# Altium schematic sheet opamps.SchDoc
size A4; Author: Benjie Van Limbergen; DrawnBy: Benjie Van Limbergen; SheetNumber: 3; SheetTotal: 4
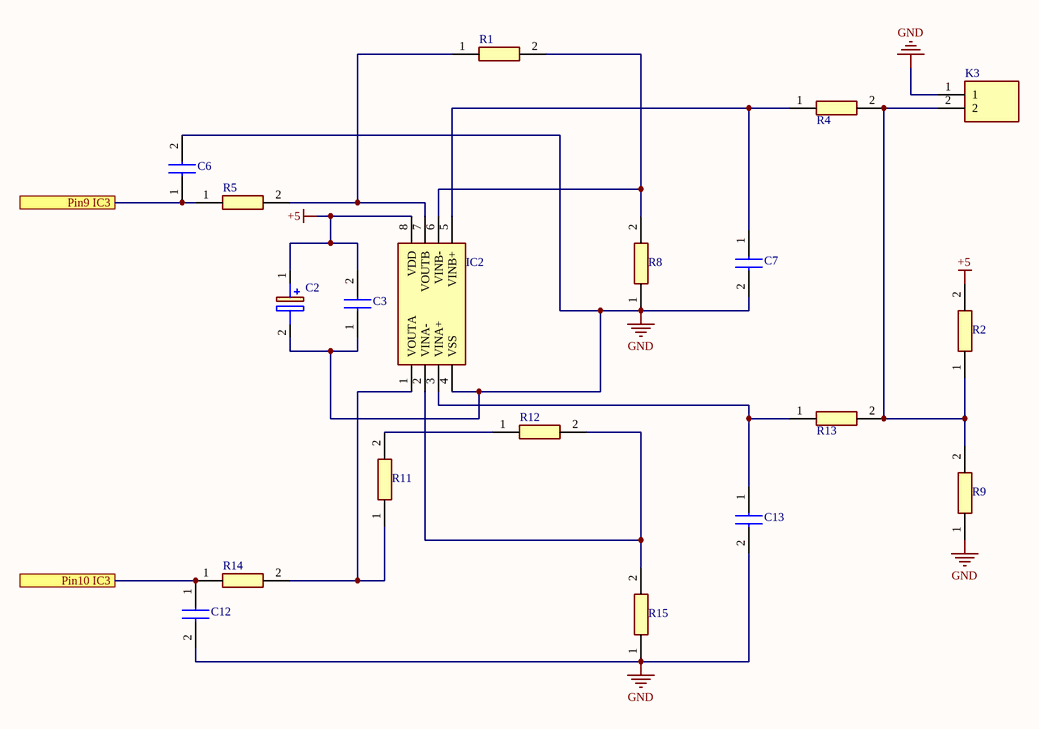
[diagram p0: opamps.SchDoc]

## Parts
C2  860240672002  [CAPPRD200W52D500H1250]  (value not drawn)
C3  885012207098  [CAPC2012X90N]  (value not drawn)
C6  885012205067  [CAPC2012X90N]  (value not drawn)
C7  885012205067  [CAPC2012X90N]  (value not drawn)
C12  885012205067  [CAPC2012X90N]  (value not drawn)
C13  885012205067  [CAPC2012X90N]  (value not drawn)
IC2  MCP6002-E_P  [DIP781W56P254L950H533Q8N]  (value not drawn)
K3  691214110002  [691214110002]  (value not drawn)
R1  smd  [RESC2012X60N]  (value not drawn)
R2  smd  [RESC2012X60N]  (value not drawn)
R4  smd  [RESC2012X60N]  (value not drawn)
R5  smd  [RESC2012X60N]  (value not drawn)
R8  smd  [RESC2012X60N]  (value not drawn)
R9  smd  [RESC2012X60N]  (value not drawn)
R11  smd  [RESC2012X60N]  (value not drawn)
R12  smd  [RESC2012X60N]  (value not drawn)
R13  smd  [RESC2012X60N]  (value not drawn)
R14  smd  [RESC2012X60N]  (value not drawn)
R15  smd  [RESC2012X60N]  (value not drawn)

## Ports
Pin9 IC3, Pin10 IC3

## Nets
+5: C2.1(+) C3.2 IC2.8(VDD) R2.2
GND: C2.2(-) C3.1 C6.2 C7.2 C12.2 C13.2 IC2.4(VSS) K3.1 R8.1 R9.1 R15.1
Pin9 IC3: C6.1 R5.1 ; port Pin9 IC3
Pin10 IC3: C12.1 R14.1 ; port Pin10 IC3
NetC7_1: C7.1 IC2.5(VINB+) R4.1
NetC13_1: C13.1 IC2.3(VINA+) R13.1
NetIC2_1: IC2.1(VOUTA) R11.1 R14.2
NetIC2_2: IC2.2(VINA-) R12.2 R15.2
NetIC2_6: IC2.6(VINB-) R1.2 R8.2
NetIC2_7: IC2.7(VOUTB) R1.1 R5.2
NetK3_2: K3.2 R2.1 R4.2 R9.2 R13.2
NetR11_2: R11.2 R12.1

## Library data of the parts
C2 = 860240672002: Capacitor Polarised 10uf 50v stee 2mm 5x11mm; Manufacturer_Name: Wurth Elektronik; Datasheet Link: https://katalog.we-online.de/pbs/datasheet/860240672002.pdf; Height: 12.5mm; Manufacturer_Part_Number: 860240672002
C3 = 885012207098: Capacitor, C3,C8,C9,C11,C14 100nf; Manufacturer_Name: Wurth Elektronik; Datasheet Link: https://componentsearchengine.com//885012207098.pdf; Height: 0.9mm; Mouser2 Part Number: 710-885012207098; Mouser2 Price/Stock: https://www.mouser.com/Search/Refine.aspx?Keyword=710-885012207098; Manufacturer_Part_Number: 885012207098
C6 C7 C12 C13 = 885012205067: Capacitor C6, C7, C12,C13; Manufacturer_Name: Wurth Elektronik; Datasheet Link: https://katalog.we-online.com/pbs/datasheet/885012205067.pdf; Height: 0.55mm; Manufacturer_Part_Number: 885012205067
IC2 = MCP6002-E_P: IC Dual Opamp; Manufacturer_Name: Microchip; Manufacturer_Part_Number: MCP6002-E/P; Datasheet Link: https://componentsearchengine.com//MCP6002-E_P.pdf; Height: 5.334mm; Mouser2 Part Number: 579-MCP6002-E/P; Mouser2 Price/Stock: https://www.mouser.com/Search/Refine.aspx?Keyword=579-MCP6002-E%2FP
K3 = 691214110002: Connector K3; Manufacturer_Name: Wurth Elektronik; Height: 8.7mm; Manufacturer_Part_Number: 691214110002
R1 R4 R5 R8 = CRCW08051M00JNEAC: 100k; Manufacturer_Name: Vishay; Datasheet Link: https://componentsearchengine.com//CRCW08051M00JNEAC.pdf; Height: 0.6mm; Mouser2 Part Number: 71-CRCW08051M00JNEAC; Mouser2 Price/Stock: https://www.mouser.com/Search/Refine.aspx?Keyword=71-CRCW08051M00JNEAC; Manufacturer_Part_Number: CRCW08051M00JNEAC
R2 = CRCW08051M00JNEAC: 1m; Manufacturer_Name: Vishay; Datasheet Link: https://componentsearchengine.com//CRCW08051M00JNEAC.pdf; Height: 0.6mm; Mouser2 Part Number: 71-CRCW08051M00JNEAC; Mouser2 Price/Stock: https://www.mouser.com/Search/Refine.aspx?Keyword=71-CRCW08051M00JNEAC; Manufacturer_Part_Number: CRCW08051M00JNEAC
R9 = CRCW08051M00JNEAC: 10m; Manufacturer_Name: Vishay; Datasheet Link: https://componentsearchengine.com//CRCW08051M00JNEAC.pdf; Height: 0.6mm; Mouser2 Part Number: 71-CRCW08051M00JNEAC; Mouser2 Price/Stock: https://www.mouser.com/Search/Refine.aspx?Keyword=71-CRCW08051M00JNEAC; Manufacturer_Part_Number: CRCW08051M00JNEAC
R11 R12 = CRCW08051M00JNEAC: 18k; Manufacturer_Name: Vishay; Datasheet Link: https://componentsearchengine.com//CRCW08051M00JNEAC.pdf; Height: 0.6mm; Mouser2 Part Number: 71-CRCW08051M00JNEAC; Mouser2 Price/Stock: https://www.mouser.com/Search/Refine.aspx?Keyword=71-CRCW08051M00JNEAC; Manufacturer_Part_Number: CRCW08051M00JNEAC
R13 R14 = CRCW08051M00JNEAC: 5k6; Manufacturer_Name: Vishay; Datasheet Link: https://componentsearchengine.com//CRCW08051M00JNEAC.pdf; Height: 0.6mm; Mouser2 Part Number: 71-CRCW08051M00JNEAC; Mouser2 Price/Stock: https://www.mouser.com/Search/Refine.aspx?Keyword=71-CRCW08051M00JNEAC; Manufacturer_Part_Number: CRCW08051M00JNEAC
R15 = CRCW08051M00JNEAC: 100ohm; Manufacturer_Name: Vishay; Datasheet Link: https://componentsearchengine.com//CRCW08051M00JNEAC.pdf; Height: 0.6mm; Mouser2 Part Number: 71-CRCW08051M00JNEAC; Mouser2 Price/Stock: https://www.mouser.com/Search/Refine.aspx?Keyword=71-CRCW08051M00JNEAC; Manufacturer_Part_Number: CRCW08051M00JNEAC